# Altium project 5V_SPI_Oled.PrjPCB
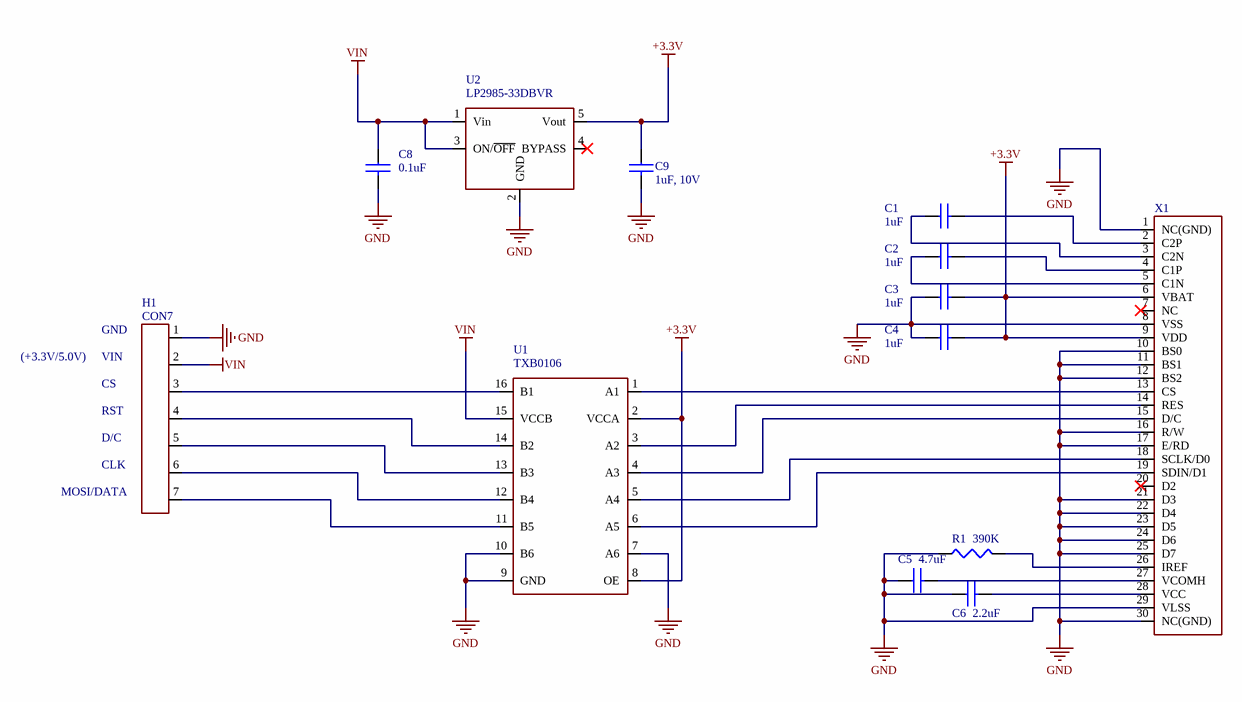
[diagram p0: 5V_SPI_Oled_Rev1.1.SchDoc]
PrjCustomer: Customer; PrjDrawnBy: XXX; PrjEngineer: XXX; PrjJobNumber: ####; PrjPartNUmber: ####-###-##; PrjRevision: #; PrjStartDate: YYYY/MM/DD; PrjTitle: Project Title; PrjTitle2: Project Title 2
1 sheet, 13 parts. Net scope: global (net labels, ports and power ports of the same name join across sheets).
Board file: 5V_SPI_Oled_Rev1.1.PcbDoc

## Sheet 5V_SPI_Oled_Rev1.1.SchDoc
size A4; CompanyName: OMNITECH ELECTRONICS INCORPORATED; Organization: Omnitech Electronics Inc.; Address1: 1-10 Akerley Blvd, Dartmouth, Nova Scotia, Canada B3B 1J4; Address2: (902) 468-5911, FAX (902) 468-5912; Address3: www.omnitechelectronics.ca; SheetTotal: 5; PageSetup: Record=PageOptions|CenterHorizontal=True|CenterVertical=True|PrintScale=1.38|XCorrection=1.00|YCorrection=1.00|PrintKind=1|BorderSize=5000000|LeftOffset=0|BottomOffset=0|Orientation=2|PaperLength=1000|PaperWidth=1000|Scale=100|PaperSource=15|PrintQuality=600|MediaType=1|DitherType=10|PaperKind=11x17|PrintScaleMode=1

### Parts
C1  1uF  [CAPC1608X90N]
C2  1uF  [CAPC1608X90N]
C3  1uF  [CAPC1608X90N]
C4  1uF  [CAPC1608X90N]
C5  4.7uF  [CAPC1608X90N]
C6  2.2uF  [CAPC1608X90N]
C8  0.1uF  [CAPC1608X90N]
C9  1uF, 10V  [CAPC1608X90N]
H1  CON7  [HDR1X7]
R1  390K  [RESC1608X55N]
U1  TXB0106  [SOP65P602X173-16N]
U2  LP2985-33DBVR  [SOT95P280X144-5N]
X1  OLED_GLASS  [OLED_GLASS]  (value not drawn)

### Nets
+3.3V: C3.2 C4.2 C9.1 U1.2(VCCA) U1.8(OE) U2.5(Vout) X1.6(VBAT) X1.9(VDD)
GND: C3.1 C4.1 C5.1 C6.1 C8.2 C9.2 H1.1 R1.1 U1.7(A6) U1.9(GND) U1.10(B6) U2.2(GND) X1.1(NC(GND)) X1.8(VSS) X1.10(BS0) X1.11(BS1) X1.12(BS2) X1.16(R/W) X1.17(E/RD) X1.21(D3) X1.22(D4) X1.23(D5) X1.24(D6) X1.25(D7) X1.29(VLSS) X1.30(NC(GND))
VIN: C8.1 H1.2 U1.15(VCCB) U2.1(Vin) U2.3(ON/~{OFF})
NetC1_1: C1.1 X1.3(C2N)
NetC1_2: C1.2 X1.2(C2P)
NetC2_1: C2.1 X1.5(C1N)
NetC2_2: C2.2 X1.4(C1P)
NetC5_2: C5.2 X1.27(VCOMH)
NetC6_2: C6.2 X1.28(VCC)
NetH1_3: H1.3 U1.16(B1)
NetH1_4: H1.4 U1.14(B2)
NetH1_5: H1.5 U1.13(B3)
NetH1_6: H1.6 U1.12(B4)
NetH1_7: H1.7 U1.11(B5)
NetR1_2: R1.2 X1.26(IREF)
NetU1_1: U1.1(A1) X1.13(CS)
NetU1_3: U1.3(A2) X1.14(RES)
NetU1_4: U1.4(A3) X1.15(D/C)
NetU1_5: U1.5(A4) X1.18(SCLK/D0)
NetU1_6: U1.6(A5) X1.19(SDIN/D1)

Not connected (* = marked no-connect by the designer): U2 4(BYPASS)*; X1 7(NC)* 20(D2)*

### Notes on the sheet
- (+3.3V/5.0V)
- (near H1) GND
- (near H1) VIN
- CS
- (near H1) RST
- (near H1) D/C
- (near H1) MOSI/DATA
- (near H1) CLK

### Library data of the parts
C1-C6 C8 = CAP_0603: CAP 0603
  C1-C4: Value: 1uF
  C5: Value: 4.7uF
  C6: Value: 2.2uF
  C8: Value: 0.1uF
C9 = C1608X7R1A105K: CAP CER 1UF 10V 10% X7R 0603; Manufacturer: TDK Corp; Order Part Number: 445-5138-1-ND; Available From: Digikey; Data Sheet: http://www.tdk.com/pdf/general_B11.pdf; Exact Part Number: C1608X7R1A105K; Operating Temp: -55 to +125; Price: $0.083; ROHS Compliant: Yes; Voltage/Pwr: 10V
H1 = CON7: CONN HEADER 7POS .100" PADS; PartNumber: PADS
R1 = RES_0603: RES 0603; Value: 390K
U1 = TXB0106IPWRQ1: IC XLATR 6B BIDIR V-LVL 16TSSOP; Manufacturer: Texas Instruments; Vendor: Digikey; PartNumber: TXB0106IPWRQ1; Value: TXB0106
U2 = LP2985-33DBVR: IC REG LDO 3.3V .15A SOT23-5; Manufacturer: Texas Instruments; PartNumber: LP2985-33DBVR
X1 = OLED_GLASS: PartNumber: N/A; Manufacturer: N/A